# EasyEDA schematic SCH_I2C-themister EasyEDA.json
TITLE: Sheet_1; REV: 1.0; Date: 2024-09-10; Sheet: 1/1; Drawn By: carolanderson0702; Company: Your Company
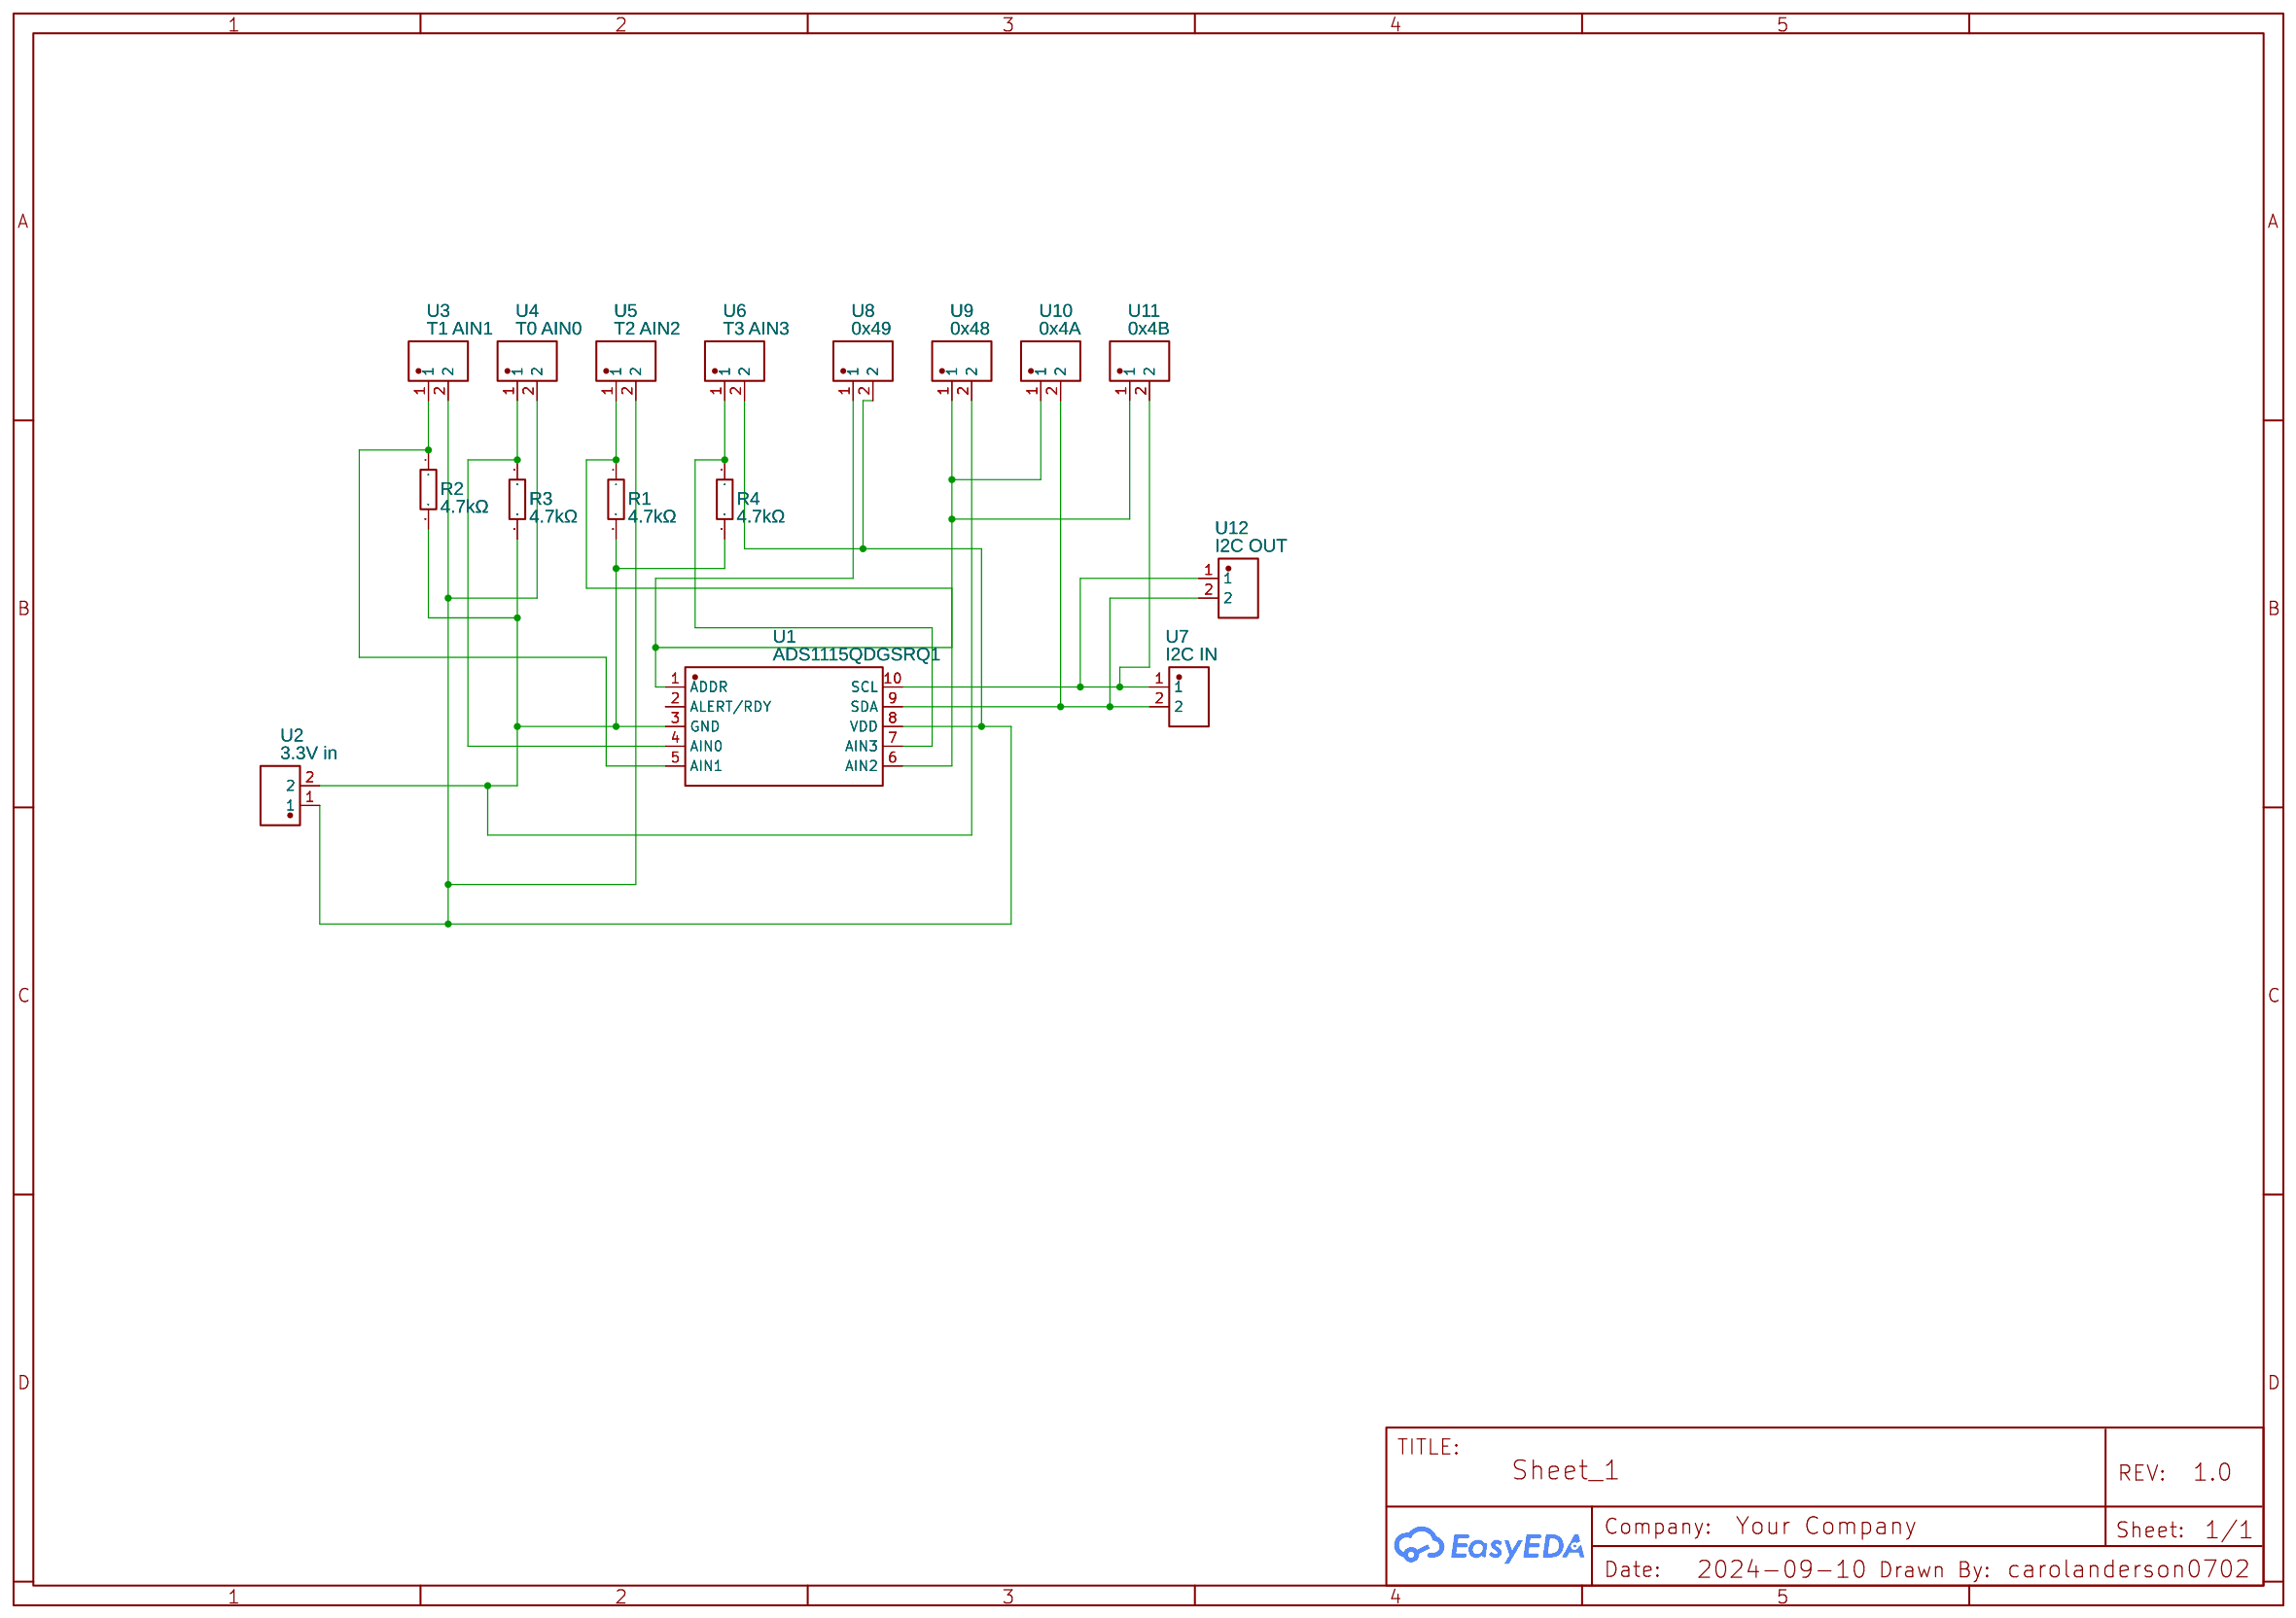
[diagram p0: schematic sheet]

## Parts
R1  4.7kΩ  [R0603]
R2  4.7kΩ  [R0603]
R3  4.7kΩ  [R0603]
R4  4.7kΩ  [R0603]
U1  ADS1115QDGSRQ1  [VSSOP-10_L3.0-W3.0-P0.50-LS4.9-BL]
U2  3.3V in  [CONN-TH_2P-P3.81_JL124D-38102G01]
U3  T1 AIN1  [HDR-TH_2P-P2.54-V-M]
U4  T0 AIN0  [HDR-TH_2P-P2.54-V-M]
U5  T2 AIN2  [HDR-TH_2P-P2.54-V-M]
U6  T3 AIN3  [HDR-TH_2P-P2.54-V-M]
U7  I2C IN  [HDR-TH_2P-P2.54-V-M]
U8  0x49  [HDR-TH_2P-P2.54-V-M]
U9  0x48  [HDR-TH_2P-P2.54-V-M]
U10  0x4A  [HDR-TH_2P-P2.54-V-M]
U11  0x4B  [HDR-TH_2P-P2.54-V-M]
U12  I2C OUT  [HDR-TH_2P-P2.54-V-M]

## Library data of the parts
R1-R4 = RC0603FR-074K7L: Supplier: LCSC; Manufacturer: YAGEO(国巨); Supplier Part: C99782; JLCPCB Part Class: Extended Part
U1 = ADS1115QDGSRQ1: Contributor: LCSC; Supplier: LCSC; Supplier Part: C172375; Manufacturer: TI(德州仪器); JLCPCB Part Class: Extended Part
U2 = JL124D-38102G01: Contributor: LCSC; Supplier: LCSC; Supplier Part: C415430; Manufacturer: JILN(锦凌); JLCPCB Part Class: Extended Part
U3-U12 = ZX-PZ2.54-1-2PZZ: Supplier: LCSC; Supplier Part: C7501260; Manufacturer: Megastar(兆星); Contributor: lcsc; JLCPCB Part Class: Extended Part

## Nets
Net-(R1-1): R1.1 U1.6(AIN2) U5.1
Net-(R1-2): R1.2 R2.2 R3.2 R4.2 U1.3(GND) U2.2 U9.2
Net-(R2-1): R2.1 U1.5(AIN1) U3.1
Net-(R3-1): R3.1 U1.4(AIN0) U4.1
Net-(R4-1): R4.1 U1.7(AIN3) U6.1
Net-(U1-1): U1.1(ADDR) U8.1 U9.1 U10.1 U11.1
Net-(U1-8): U1.8(VDD) U2.1 U3.2 U4.2 U5.2 U6.2 U8.2
Net-(U1-9): U1.9(SDA) U7.2 U10.2 U12.2
Net-(U1-10): U1.10(SCL) U7.1 U11.2 U12.1

Not connected (* = marked no-connect by the designer): U1 2(ALERT/RDY)
